# EAGLE design amp_lm1876_ocl_v2 (EAGLE 9.6.2)
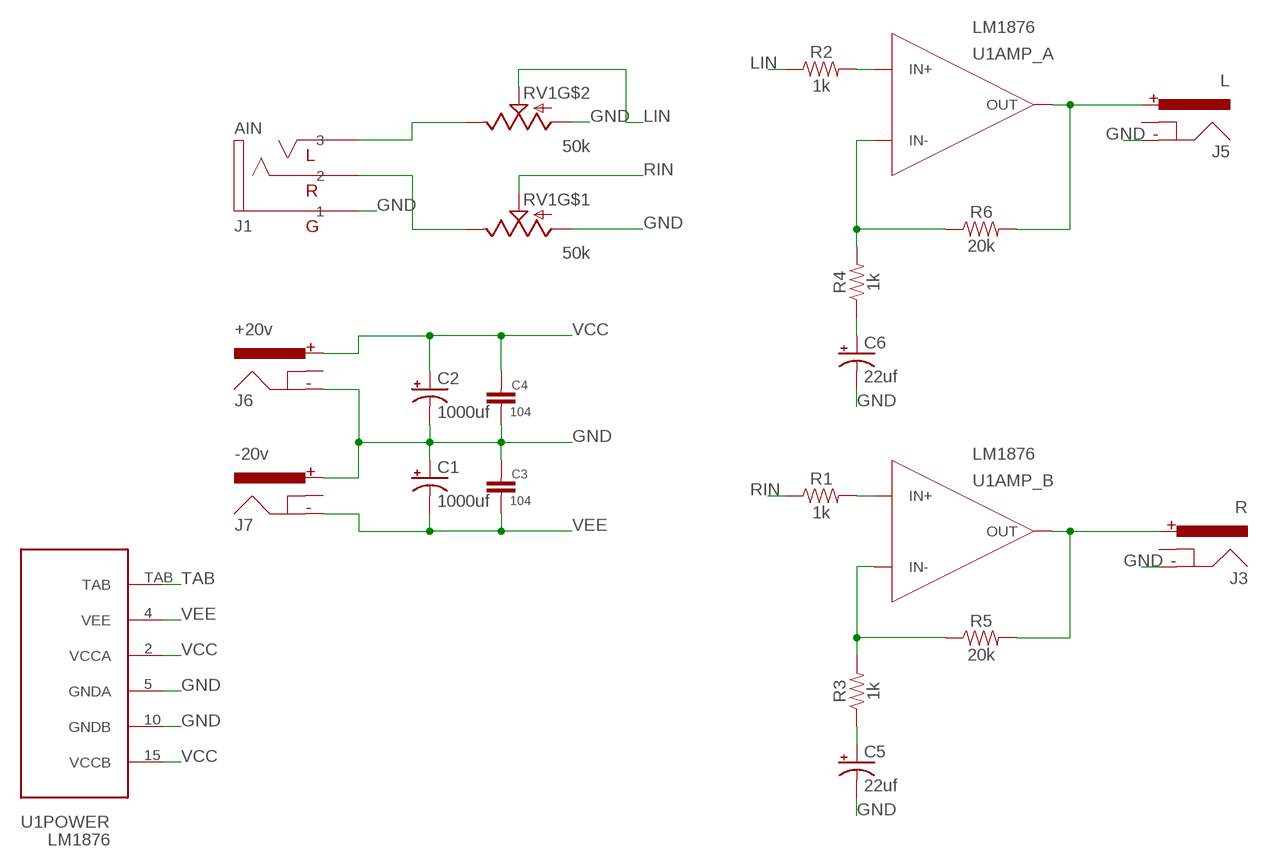
[diagram p0: schematic, sheet 1]

## Parts
C1  1000uf  CAP5MM  [CAP_5MM_10D]
C2  1000uf  CAP5MM  [CAP_5MM_10D]
C3  104  CAP_SMDC0603  [C0603]
C4  104  CAP_SMDC0603  [C0603]
C5  22uf  CAP  [CAP_2.5MM]
C6  22uf  CAP  [CAP_2.5MM]
J1  AIN  3.5MM_PHONE  [3.5MM]
J3  R  POWER_JACKPTH_LOCK  [POWER_JACK_PTH_LOCK]
J5  L  POWER_JACKPTH_LOCK  [POWER_JACK_PTH_LOCK]
J6  +20v  POWER_JACKPTH_LOCK  [POWER_JACK_PTH_LOCK]
J7  -20v  POWER_JACKPTH_LOCK  [POWER_JACK_PTH_LOCK]
R1  1k  RESISTOR_SMDR0603  [R0603]
R2  1k  RESISTOR_SMDR0603  [R0603]
R3  1k  RESISTOR_SMDR0603  [R0603]
R4  1k  RESISTOR_SMDR0603  [R0603]
R5  20k  RESISTOR_SMDR0603  [R0603]
R6  20k  RESISTOR_SMDR0603  [R0603]
RV1  50k  POT_DUALPOT_DUAL_GREEN  [POT_DUAL_GREEN]
U1  LM1876  LM1876MULTIWATT15  [MULTIWATT15_FLAT]

## Nets
GND: C1.+ C2.- C3.1 C4.2 C5.- C6.- J1.P$1 J3.GND J5.GND J6.GND J7.PWR RV1.P$1(A) RV1.P$4(A) U1.5(POWER:GNDA) U1.10(POWER:GNDB)
LIN: R2.1 RV1.P$5(S)
LOUT: J5.PWR R6.2 U1.3(AMP_A:OUT)
N$1: R4.2 R6.1 U1.7(AMP_A:IN-)
N$2: R2.2 U1.8(AMP_A:IN+)
N$3: C6.+ R4.1
N$5: R1.2 U1.13(AMP_B:IN+)
N$6: R3.2 R5.1 U1.12(AMP_B:IN-)
N$7: C5.+ R3.1
N$8: J1.P$3 RV1.P$6(E)
N$9: J1.P$2 RV1.P$3(E)
RIN: R1.1 RV1.P$2(S)
ROUT: J3.PWR R5.2 U1.1(AMP_B:OUT)
TAB: U1.TAB(POWER:TAB)
VCC: C2.+ C4.1 J6.PWR U1.2(POWER:VCCA) U1.15(POWER:VCCB)
VEE: C1.- C3.2 J7.GND U1.4(POWER:VEE)
Unconnected: J3.GNDBREAK J5.GNDBREAK J6.GNDBREAK J7.GNDBREAK U1.6(CTRL:MUTEA) U1.9(CTRL:STBYA) U1.11(CTRL:MUTEB) U1.14(CTRL:STBYB)

## Library data of the parts
C1 C2 C5 C6 = Capacitors:CAP
C3 C4 = Capacitors:CAP_SMD
J1 = Connectors:3.5MM_PHONE: 描述： 类型：3.5mm耳机插口 接口：三段式 连接：https://item.szlcsc.com/19296.html
J3 J5-J7 = Connectors:POWER_JACK: Power Jack Connector This is the standard 5.5mm barrel jack for power. The PTH is the most common, proven, reliable, footprint. The Slot footprint only works if the mill layer is transmitted to the PCB fab house so be warned. Here are the connectors we sell at SparkFun: DC Barrel Power Jack/Connector <https://www.sparkfun.com/products/119> (PRT-00119) DC Barrel Power Jack/Connector (SMD) <https://www.sparkfun.com/products/12748> (PRT-12748) DC Barrel Jack Adapter - Breadboard Compatible <https://www.sparkfun.com/products/10811> (PRT-10811) It is used on this SparkFun product (and many, many others): SparkFun RedBoard - Programmed with Arduino <https://www.sparkfun.com/products/12757> (DEV-12757) Also, if you need a mating power supply or connector, please check these out: Wall Adapter Power Supply - 9VDC 650mA <https://www.sparkfun.com/products/298> (TOL-00298) DC Barrel Jack Adapter - Male <https://www.sparkfun.com/products/10287> (PRT-10287); PROD_ID: CONN-08197; SF_ID: PRT-00119
R1-R6 = Resistors:RESISTOR_SMD
RV1 = xmgu2008:POT_DUAL
U1 = IC-Amplifiers:LM1876

## Board
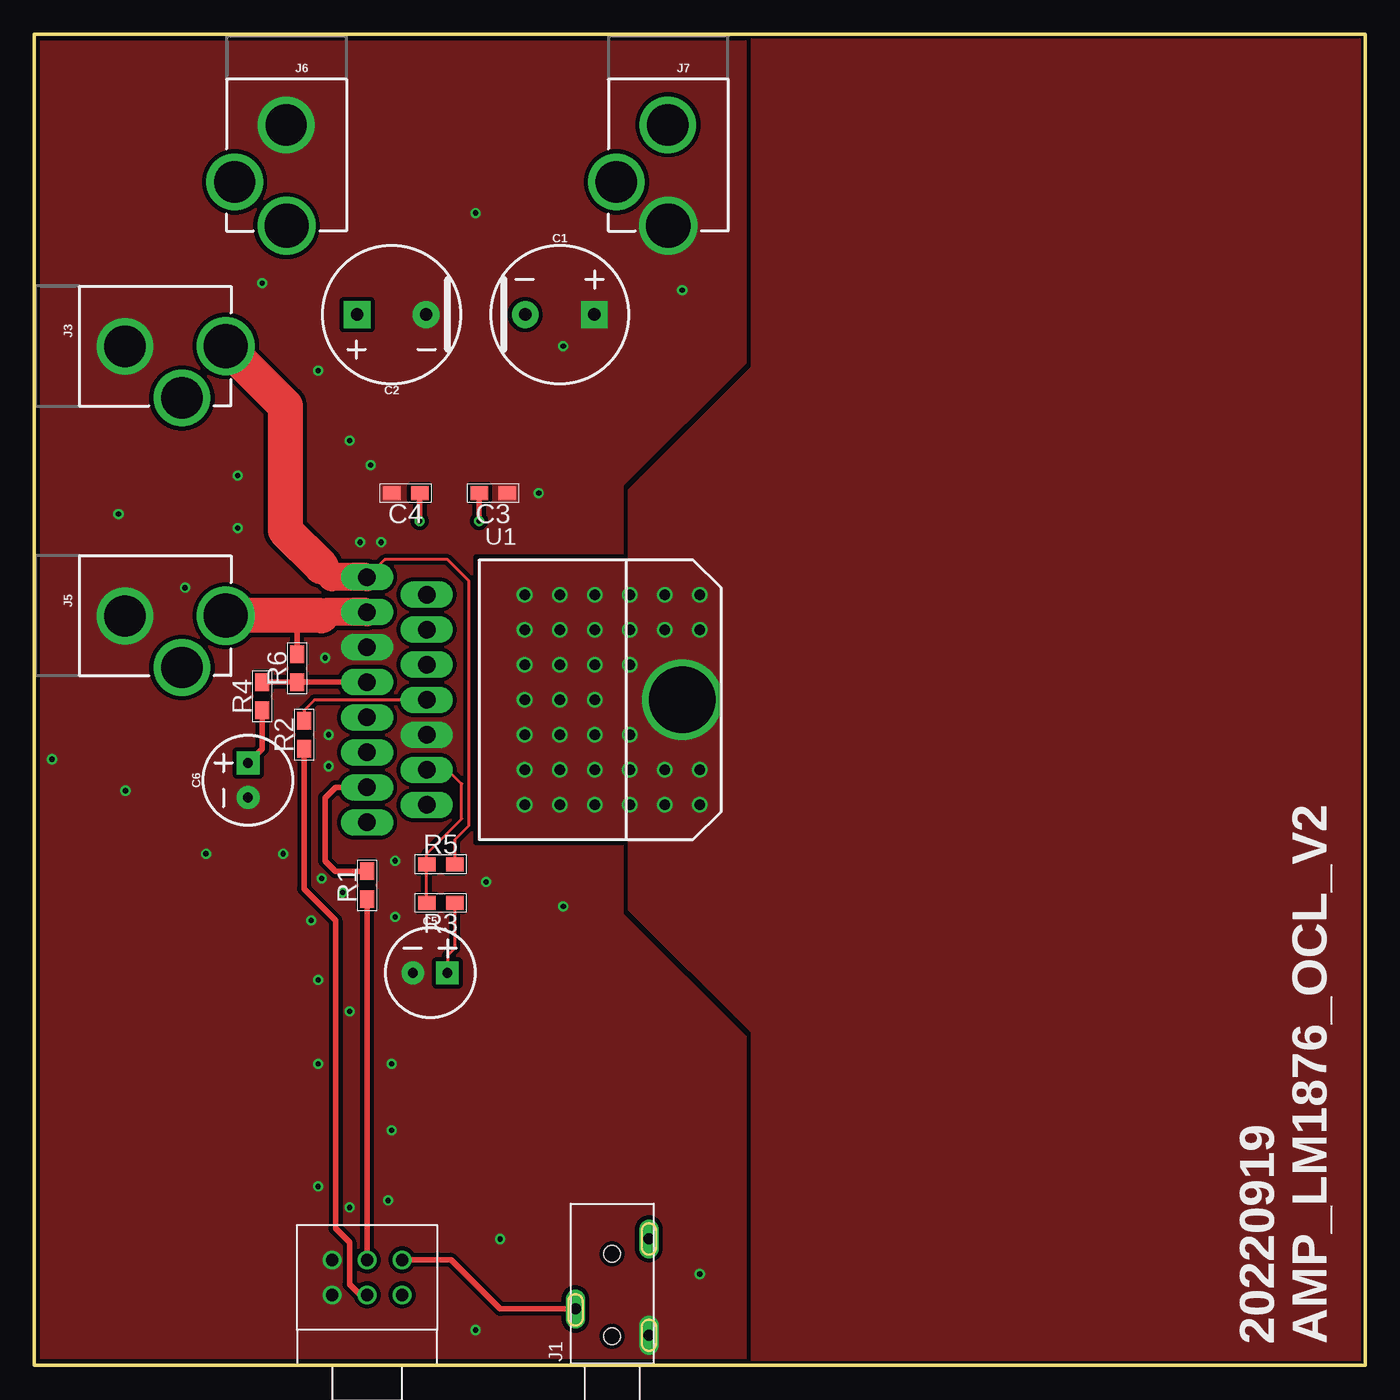
[diagram p1: board, top side]
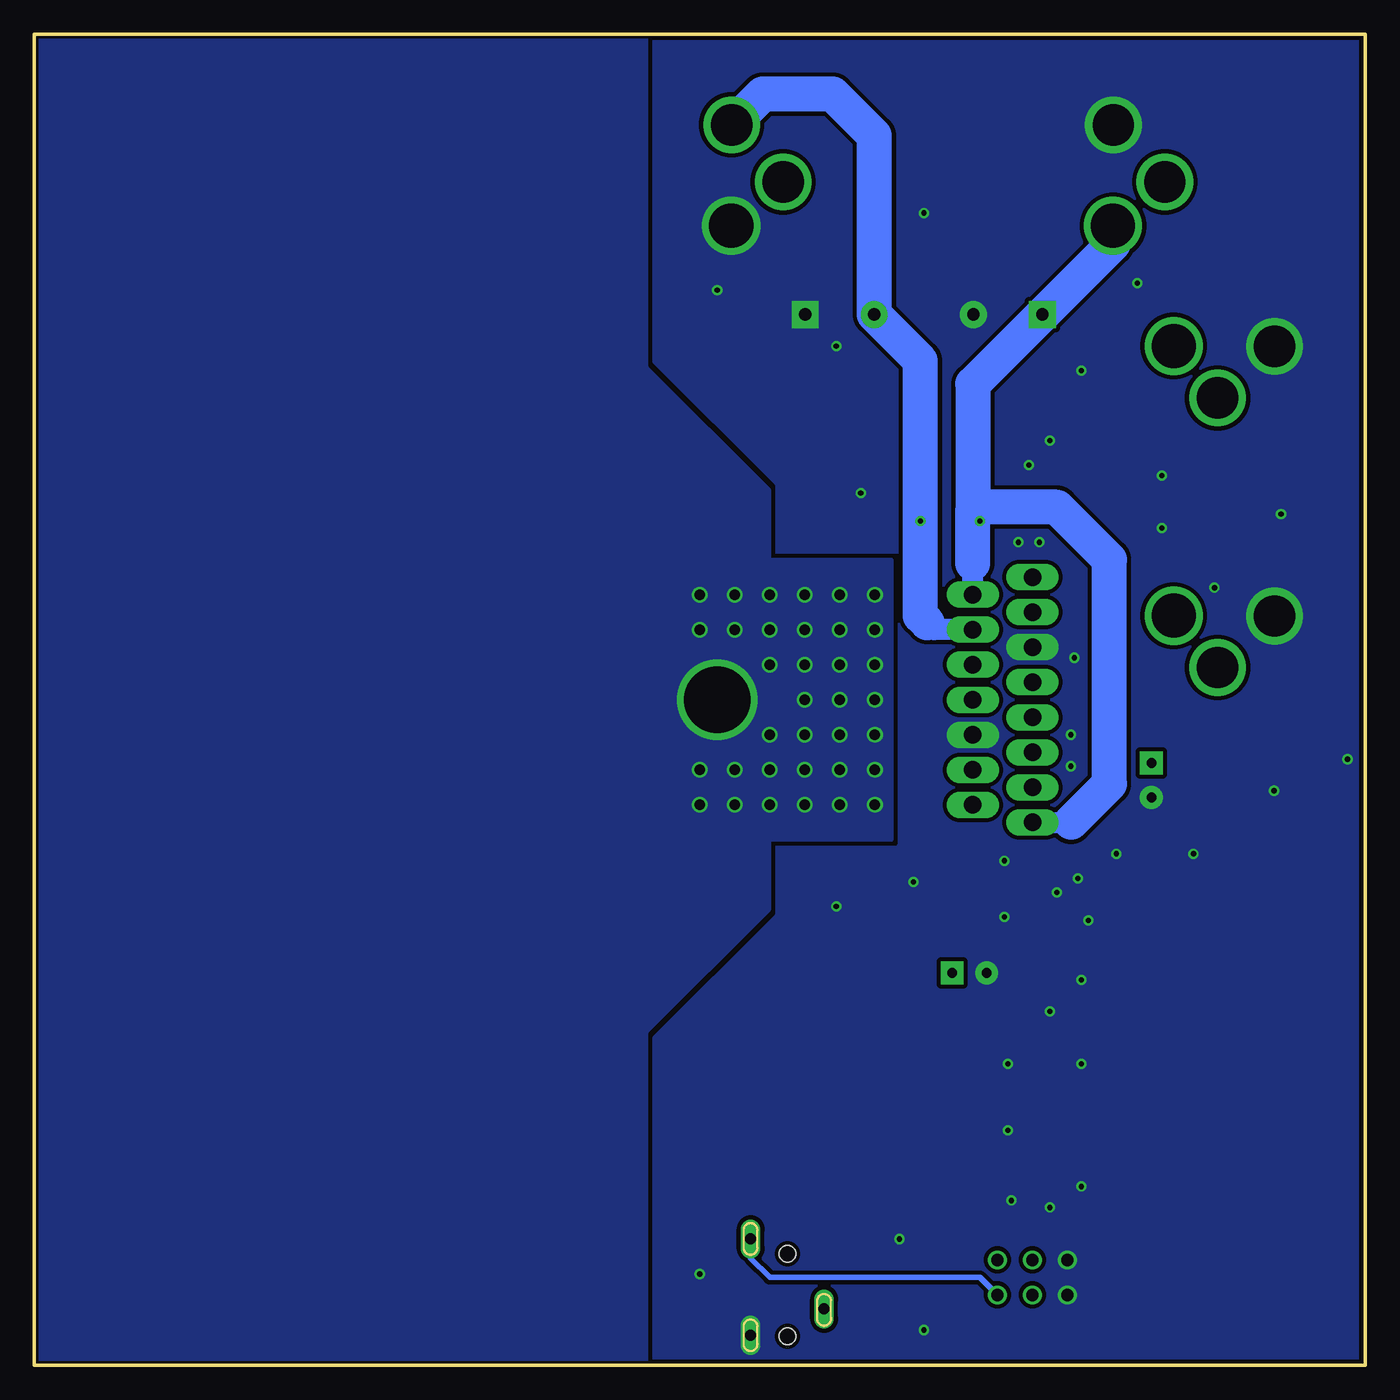
[diagram p2: board, bottom side, seen from below]

Size 96.52 x 96.52 mm. Coordinates in mm from the lower left corner, seen from the top.
Outline: 0,0 0,96.52 96.52,96.52 96.52,0 0,0
Copper layers (1*16): Top 0.035mm / dielectric 1.5mm / Bottom 0.035mm
Design rules "SparkFun-2-Layer-General-JLCPCB": minimum track width 7mil, minimum drill 0.3mm, track to track 7mil, track to pad 7mil, pad to pad 7mil, via to via 7mil, smd to smd 7mil, copper to edge 7mil, drill to drill 7mil, minimum pad ring 7mil, minimum via ring 7mil, stop-mask expansion 3mil, vias tented up to drill 25mil, thermal gap 10mil

### Footprints (pad centres in the part's own frame; a part is rotated, then mirrored left to right if it is on the bottom)
CAP_5MM_10D = drill 0.9 pad 1.93 square: + 2.5,0 | drill 0.9 pad 1.93: - -2.5,0
C0603 = smd 1.27 x 1.016: 1 -1.016,0; 2 1.016,0
CAP_2.5MM = drill 0.7 pad 1.651 square: + 1.25,0 | drill 0.7 pad 1.651: - -1.25,0
3.5MM = drill 0.8 pad 1.422 long: P$1 -2.921,-2.667; P$2 -1.016,2.667; P$3 4.064,-2.667 | hole 1.2: -3,0; 3,0
POWER_JACK_PTH_LOCK = drill 2.997 pad 4.115: GND 0.025,6.557; GNDBREAK 3.762,10.7 | drill 3.2 pad 4.115: PWR 0,13.878
R0603 = smd 1.27 x 1.016: 1 -1.016,0; 2 1.016,0
POT_DUAL_GREEN = drill 0.9: P$1 -2.54,2.54; P$2 0,2.54; P$3 2.54,2.54; P$4 -2.54,0; P$5 0,0; P$6 2.54,0
MULTIWATT15_FLAT = drill 1.27 pad 1.651 long: 1 -8.89,0; 2 -7.62,4.318; 3 -6.35,0; 4 -5.08,4.318; 5 -3.81,0; 6 -2.54,4.318; 7 -1.27,0; 8 0,4.318; 9 1.27,0; 10 2.54,4.318; 11 3.81,0; 12 5.08,4.318; 13 6.35,0; 14 7.62,4.318; 15 8.89,0 | drill 4.826 pad 5.334: TAB 0,22.86

### Placement (x,y rotation side)
C1  38.1,76.2 0 top
C2  25.91,76.2 180 top
C3  33.27,63.25 180 top
C4  26.92,63.25 180 top
C5  28.7,28.45 0 top
C6  15.49,42.42 90 top
J1  41.91,5.08 90 top
J3  0,73.91 270 top
J5  0,54.36 270 top
J6  18.29,96.52 180 top
J7  45.97,96.52 180 top
R1  24.13,34.8 90 top
R2  19.56,45.72 90 top
R3  29.46,33.53 180 top
R4  16.51,48.51 90 top
R5  29.46,36.32 0 top
R6  19.05,50.55 90 top
RV1  24.13,5.08 0 top
U1  24.13,48.26 270 top

### Tracks (layer width: path | path; a pad name or v marks a point on that pad's centre or on a via)
GND  (via drill 0.38)
  other vias: 6.6,41.66 1.27,43.94 12.45,37.08 20.07,32.26 25.91,21.84 14.73,60.71 23.62,59.69 22.86,67.06 38.35,73.91 32,83.57 16.51,78.49 20.57,72.14 10.92,56.39 6.1,61.72 20.57,27.94 38.35,33.27 25.65,11.94 36.58,63.25 46.99,77.98 24.38,65.28 21.34,43.43 26.16,36.58 26.16,32.51 32.77,35.05 18.03,37.08 14.73,64.52 32,2.54 33.78,9.14 48.26,6.6 20.57,12.95 25.91,17.02 20.57,21.84 25.15,59.69 21.34,45.72 22.35,34.29 20.83,35.31 22.86,25.65 22.86,11.43 21.08,51.31
  pour Top (isolate 0.305, rank 2, no thermals): 0,0 0,96.52 96.52,96.52 96.52,0
  pour Bottom (isolate 0.305, rank 2, no thermals): 0,0 0,96.52 96.52,96.52 96.52,0
LIN
  Top 0.406: R2.1 19.56,34.54 21.84,32.26 21.84,9.91 22.86,8.89 22.86,5.84 23.62,5.08 RV1.P$5
LOUT
  Top 0.406: R6.2 19.05,54.36
  Top 2.032: U1.3 21.08,54.61 20.83,54.36
  Top 2.54: 20.83,54.36 19.05,54.36 J5.PWR
N$1
  Top 0.406: U1.7 R6.1 R4.2
N$2
  Top 0.203: R2.2 19.56,47.5 20.32,48.26 U1.8
N$3
  Top 0.406: R4.1 16.51,44.68 C6.+
N$5
  Top 0.406: R1.2 21.84,35.81 21.08,36.58 21.08,41.15 21.84,41.91 U1.13
N$6
  Top 0.203: R3.2 R5.1 28.45,37.08 30.99,39.62 30.99,42.16 29.97,43.18 U1.12
N$7
  Top 0.203: R3.1 30.48,30.23 29.95,29.7 C5.+
N$8
  Bottom 0.406: J1.P$3 44.58,7.75 43.18,6.35 27.94,6.35 RV1.P$6
N$9
  Top 0.406: J1.P$2 33.78,4.06 30.23,7.62 RV1.P$3
RIN
  Top 0.406: RV1.P$2 R1.1
ROUT
  Top 0.203: R5.2 30.48,38.1 31.5,39.12 31.5,56.9 29.97,58.42 25.4,58.42 U1.1
  Top 2.032: U1.1 21.59,57.15 20.83,57.91
  Top 2.54: 20.83,57.91 18.2,60.54 18.2,69.6 J3.PWR
TAB  (via drill 0.76)
  other vias: 35.56,55.88 38.1,55.88 40.64,55.88 43.18,55.88 45.72,55.88 48.26,55.88 48.26,53.34 45.72,53.34 43.18,53.34 40.64,53.34 38.1,53.34 35.56,53.34 35.56,50.8 35.56,48.26 35.56,45.72 35.56,43.18 35.56,40.64 38.1,40.64 40.64,40.64 43.18,40.64 45.72,40.64 48.26,40.64 48.26,43.18 45.72,43.18 43.18,43.18 40.64,43.18 38.1,43.18 38.1,45.72 40.64,45.72 43.18,45.72 40.64,48.26 38.1,48.26 38.1,50.8 40.64,50.8 43.18,50.8
  pour Top (no thermals): 32.26,58.42 43.18,58.42 43.18,63.5 52.07,72.39 52.07,96.52 96.52,96.52 96.52,0 52.07,0 52.07,24.13 43.18,33.02 43.18,38.1 32.26,38.1
  pour Bottom (no thermals): 34.29,38.1 34.29,58.42 43.18,58.42 43.18,63.5 52.07,72.39 52.07,96.52 96.52,96.52 96.52,0 52.07,0 52.07,24.13 43.18,33.02 43.18,38.1
VCC  (via drill 0.35)
  Top 0.406: C4.1 v27.94,61.21
  Bottom 0.406: 28.19,62.23 27.94,61.98 v27.94,61.21
  Bottom 1.524: U1.15 21.34,39.37 | U1.2 28.45,58.17
  Bottom 2.54: 28.45,58.17 28.45,59.94 28.45,61.98 | 28.45,61.98 28.19,62.23 22.35,62.23 18.54,58.42 18.54,42.16 21.34,39.37 | 28.45,61.98 28.45,71.16 C2.+ 18.29,81.32 J6.PWR
VEE  (via drill 0.35)
  Top 0.406: C3.2 v32.26,61.21
  Bottom 1.524: U1.4 31.24,53.34 31.75,53.85
  Bottom 2.54: 31.75,53.85 32.26,54.36 v32.26,61.21 32.26,72.86 C1.- 35.6,89.19 38.61,92.2 43.71,92.2 J7.GND

### Text on the board
tPlace: 20220919 | AMP_LM1876_OCL_V2